# Altium schematic sheet usb_uart.SchDoc: Edison Gateway - Serial
size Letter; Author: Ye-Sheng Kuo; DocumentNumber: 7; Revision: 3; SheetNumber: 7; SheetTotal: 10
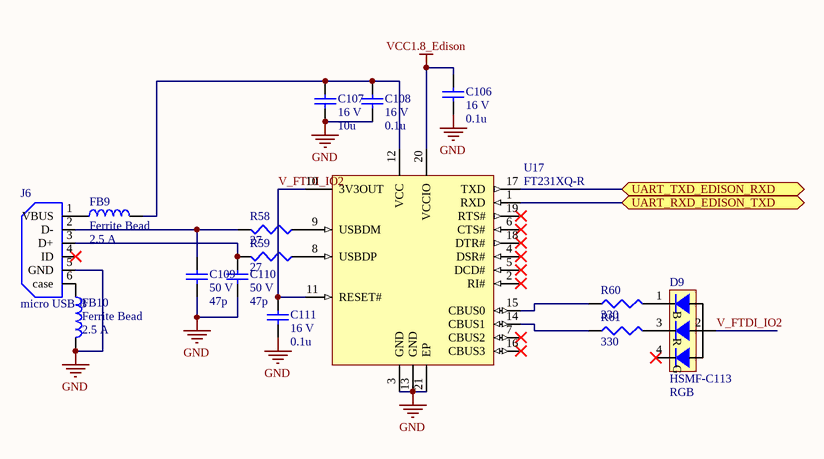
[diagram p0: usb_uart.SchDoc]

## Parts
C106  voltage rated: 16 V  [0402]  (hidden comment: 0.1u)
C107  voltage rated: 16 V  [0603]  (hidden comment: 10u)
C108  voltage rated: 16 V  [0402]  (hidden comment: 0.1u)
C109  voltage rated: 50 V  [0402]  (hidden comment: 47p)
C110  voltage rated: 50 V  [0402]  (hidden comment: 47p)
C111  voltage rated: 16 V  [0402]  (hidden comment: 0.1u)
D9  HSMF-C113  value RGB  [HSMF]
FB9  Ferrite Bead  Current Rating (Max): 2.5 A  [0603]
FB10  Ferrite Bead  Current Rating (Max): 2.5 A  [0603]
J6  micro USB-B  [Micro USB-B]
R58  27  [0402]
R59  27  [0402]
R60  330  [0402]
R61  330  [0402]
U17  FT231XQ-R  [QFN-20_N]

## Ports
UART_RXD_EDISON_TXD, UART_TXD_EDISON_RXD

## Nets
GND: C106.2 C107.2 C108.2 C109.2 C110.2 C111.2 FB10.1 J6.5(GND) U17.3(GND) U17.13(GND) U17.21(EP)
VCC1.8_Edison: C106.1 U17.20(VCCIO)
UART_RXD_EDISON_TXD: U17.1(RXD) ; port UART_RXD_EDISON_TXD
UART_TXD_EDISON_RXD: U17.17(TXD) ; port UART_TXD_EDISON_RXD
V_FTDI_IO2: C111.1 D9.2 U17.10(3V3OUT) U17.11(RESET#)
NetC107_1: C107.1 C108.1 FB9.1 U17.12(VCC)
NetC109_1: C109.1 J6.2(D-) R58.1
NetC110_1: C110.1 J6.3(D+) R59.1
NetD9_1: D9.1 R60.1
NetD9_3: D9.3 R61.1
NetFB9_2: FB9.2 J6.1(VBUS)
NetFB10_2: FB10.2 J6.6(case)
NetR58_2: R58.2 U17.9(USBDM)
NetR59_2: R59.2 U17.8(USBDP)
NetR60_2: R60.2 U17.15(CBUS0)
NetR61_2: R61.2 U17.14(CBUS1)

Not connected (* = marked no-connect by the designer): D9 4*; J6 4(ID)*; U17 2(RI#)* 4(DSR#)* 5(DCD#)* 6(CTS#)* 7(CBUS2)* 16(CBUS3)* 18(DTR#)* 19(RTS#)*

## Notes on the sheet
- Title
- Date:
- Author:
- Revision:
- Sheet
- of
- University of Michigan
- File:
- (in symbol HSMF-C113) B; R; G

## Library data of the parts
C106 C108 C111 = GRM155R71C104KA88D: 0.10µF ±10% 16V Ceramic Capacitor X7R 0402; Manufacture: Murata; tolerance: 10%; package: 0402; Supplier 1: Digi-Key; Supplier Part Number 1: 490-3261-1-ND; Value: 0.1u; Temperature Coefficient: X7R; Manufacturer Part Number: GRM155R71C104KA88D
C107 = GRM188C81C106MA73D: 10µF ±20% 16V Ceramic Capacitor X6S 0603; Manufacture: Murata; tolerance: 20%; package: 0603; Temperature Coefficient: X6S; Supplier 1: Digi-Key; Supplier Part Number 1: 490-7198-1-ND; Value: 10u; Manufacturer Part Number: GRM188C81C106MA73D
C109 C110 = 500R07N470JV4T: 47pF ±5% 50V Ceramic Capacitor C0G, NP0 0402; Manufacture: Johanson Dielectrics Inc.; tolerance: 5%; package: 0402; Supplier 1: Digi-Key; Supplier Part Number 1: 709-1121-1-ND; Value: 47p; Temperature Coefficient: C0G, NP0; Manufacturer Part Number: 500R07N470JV4T
D9 = HSMF-C113: Red, Green, Blue (RGB) 626nm Red, 572nm Green, 470nm Blue LED Indication - Discrete 1.9V Red, 2V Green, 3.4V Blue 4-SMD; Manufacturer: Broadcom Limited; Supplier 1: Digi-Key; Supplier Part Number 1: 516-2232-1-ND; Manufacturer Part Number: HSMF-C113; Wavelength: 626nm Red, 572nm Green, 470nm Blue
FB9 FB10 = BLM18SG221TN1D: FERRITE BEAD 220 OHM 0603; Manufacturer: Murata; DC resistance: 40m; Impedance @ Frequency: 220 Ohm @ 100MHz; package: 0603; Supplier 1: Digi-Key; Supplier Part Number 1: 490-5225-1-ND; Manufacturer Part Number: BLM18SG221TN1D
J6 = Micro USB: CONN USB MICRO B RECPT SMT R/A; Supplier 1: Digi-Key; Supplier Part Number 1: 609-4616-1-ND
R58 R59 = CRCW040227R0FKED: RES SMD 27 OHM 1% 1/16W 0402; Manufacturer: Vishay Dale; Temperature Coefficient: 100 ppm/C; Tolerance: 1%; Power: 1/16 W; package: 0402; Supplier 1: Digi-Key; Supplier Part Number 1: 541-27.0LCT-ND; value: 27; Manufacturer Part Number: CRCW040227R0FKED
R60 R61 = CRCW0402330RFKED: RES SMD 330 OHM 1% 1/16W 0402; Manufacturer: Vishay Dale; Temperature Coefficient: 100 ppm/C; Tolerance: 1%; Power: 1/16 W; package: 0402; Supplier 1: Digi-Key; Supplier Part Number 1: 541-330LCT-ND; value: 330; Manufacturer Part Number: CRCW0402330RFKED
U17 = FT231XQ-R: USB to Full-Handshake UART Interface Chip, UHCI/OHCI/EHCI Compatible, USB 2.0 Compatible, -40 to +85 degC, 20-Pin QFN, Pb-Free, Tape and Reel; Manufacturer: FTDI; DatasheetVersion: ver 1.2, Feb-2013; PackageVersion: Feb-13; PackageReference: QFN-20; PackageDescription: 20-Pin Quad Flat No-Lead, 4 x 4 mm Body, 0.5 mm Pitch; Code_JEDEC: MO-220WGGD-1; PartNumber: FT231XQ-R; ComponentLink1Description: Manufacturer URL; ComponentLink1URL: http://www.ftdichip.com/; ComponentLink2Description: Datasheet; ComponentLink2URL: http://www.ftdichip.com/Support/Documents/DataSheets/ICs/DS_FT231X.pdf; ComponentLink3Description: FT231X Product Page; ComponentLink3URL: www.ftdichip.com/Products/ICs/FT231X.html; Supplier 1: Digi-Key; Supplier Part Number 1: 768-1155-ND